# EasyEDA Pro project ProPrj_Multi-Puporse Circuit System Final_2026-03-23.epro, board PCB1
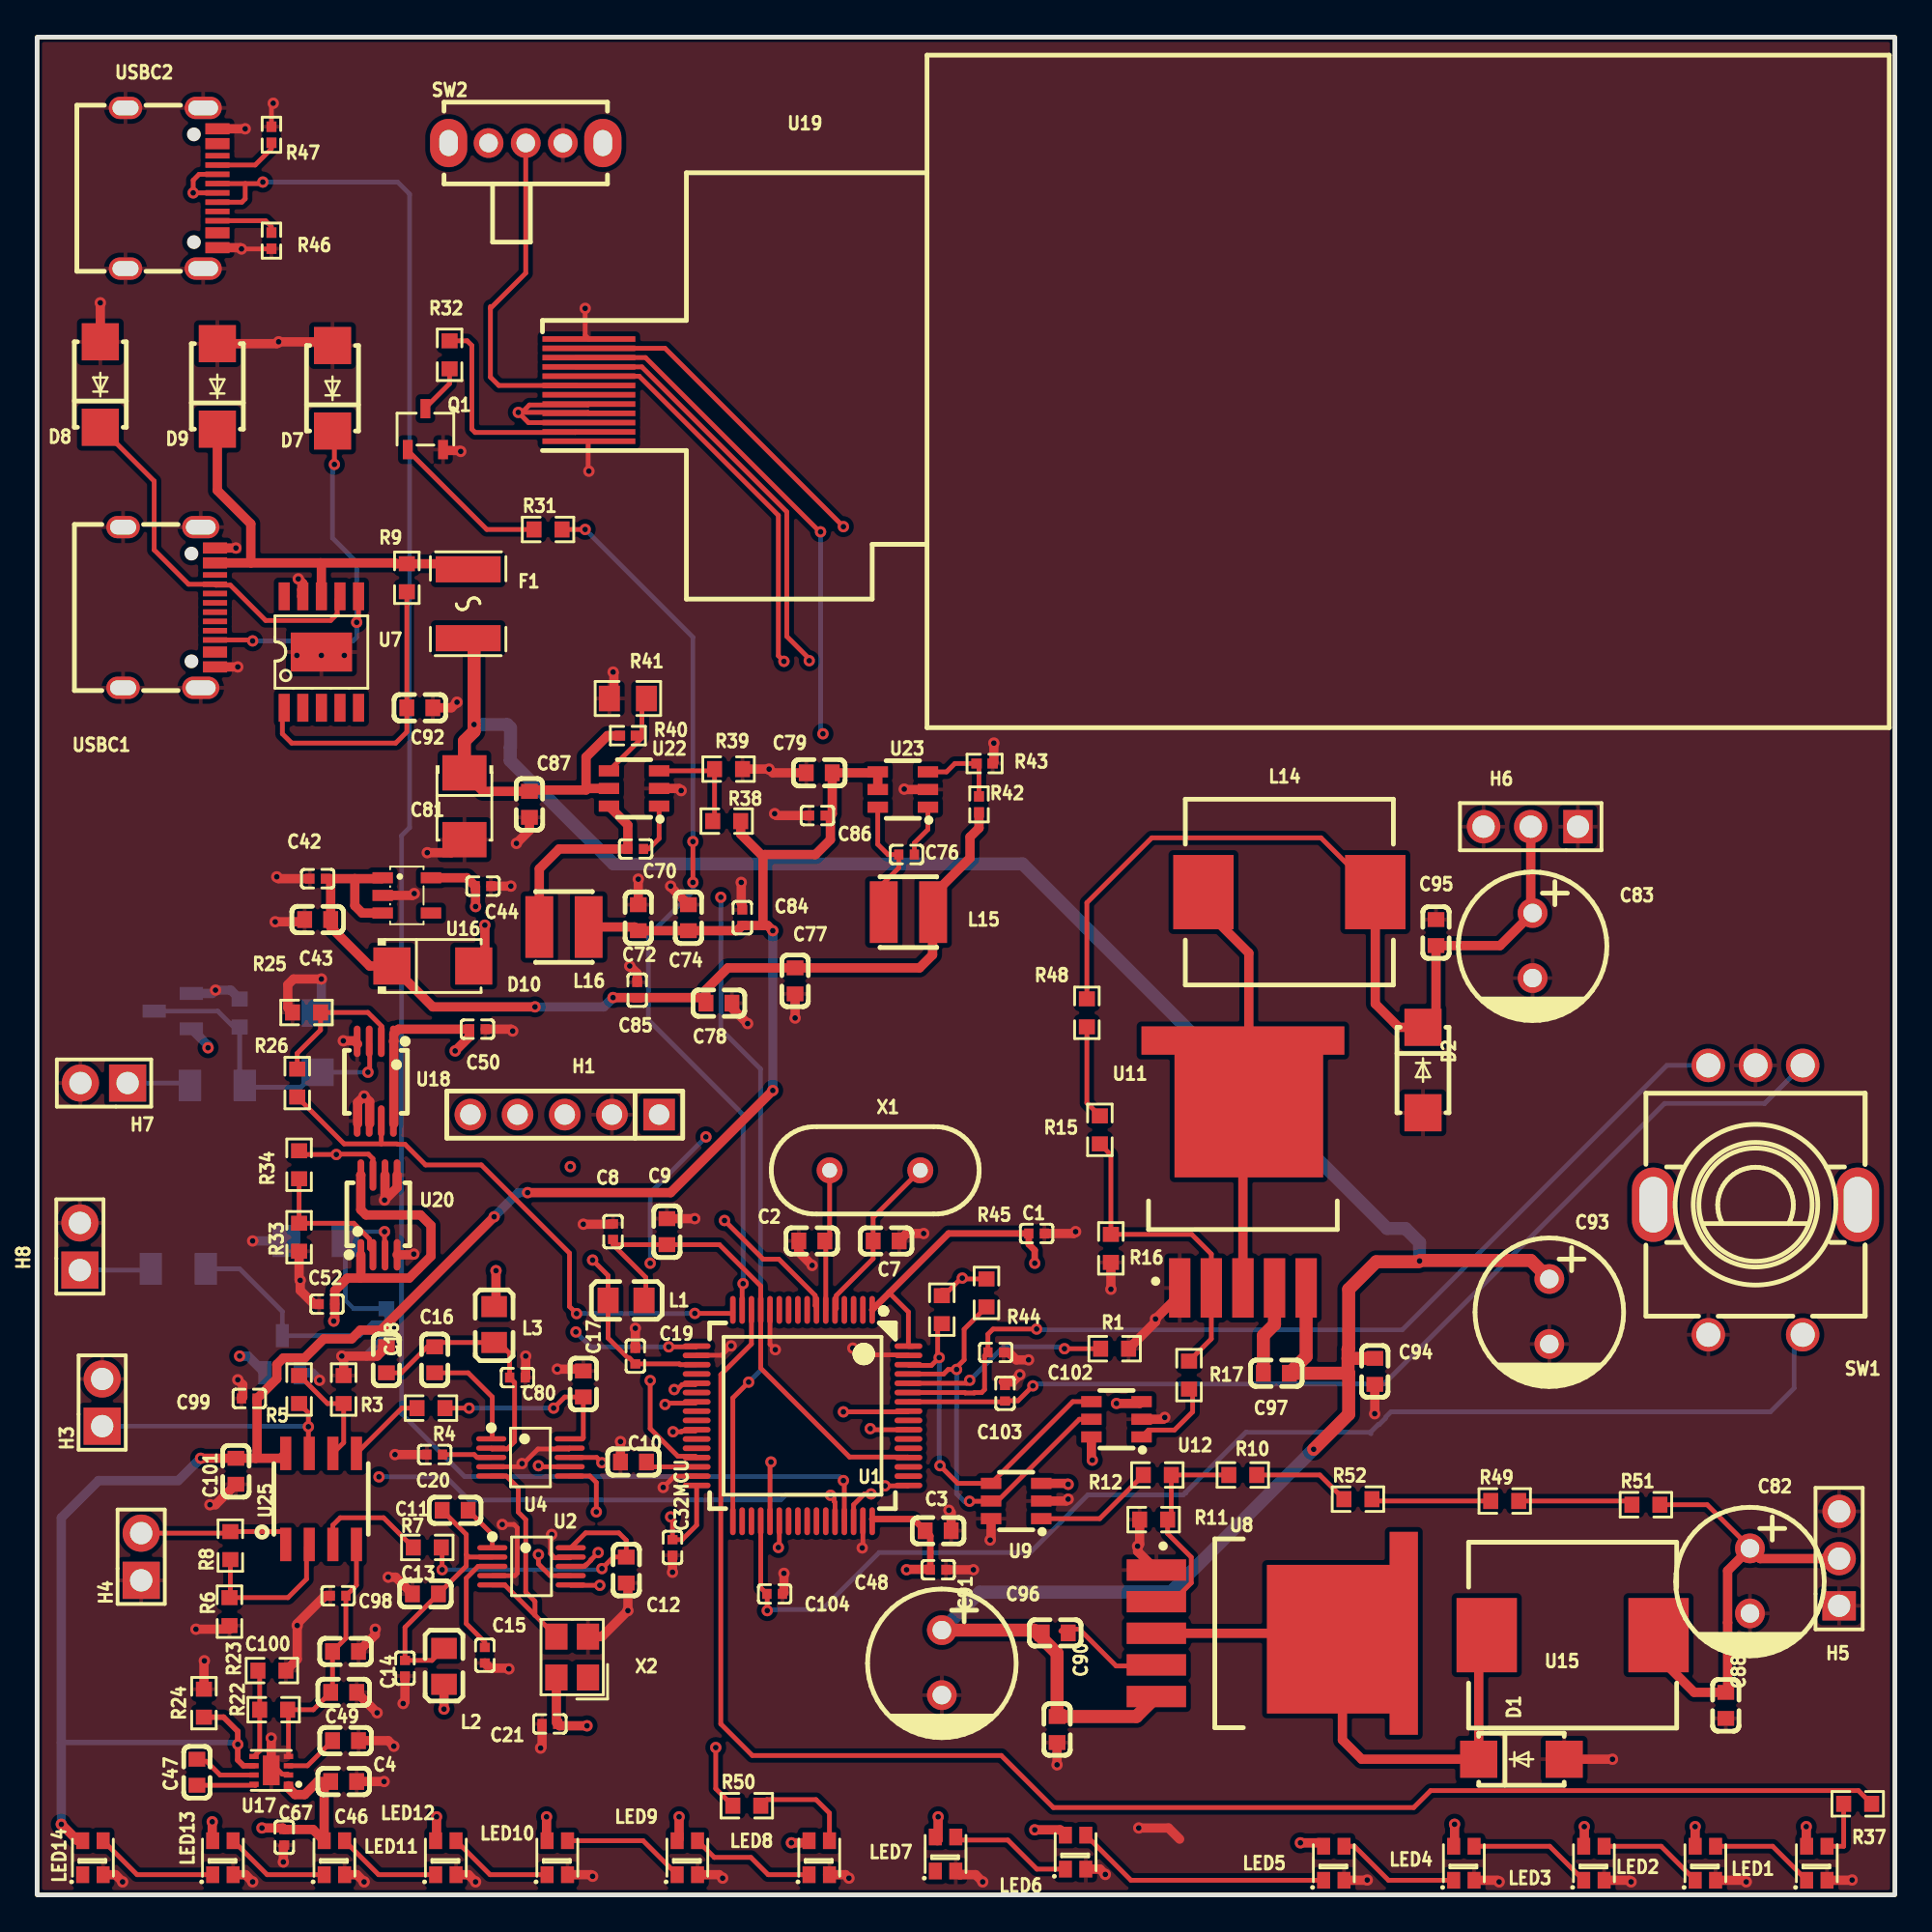
[diagram p1: board, top side]
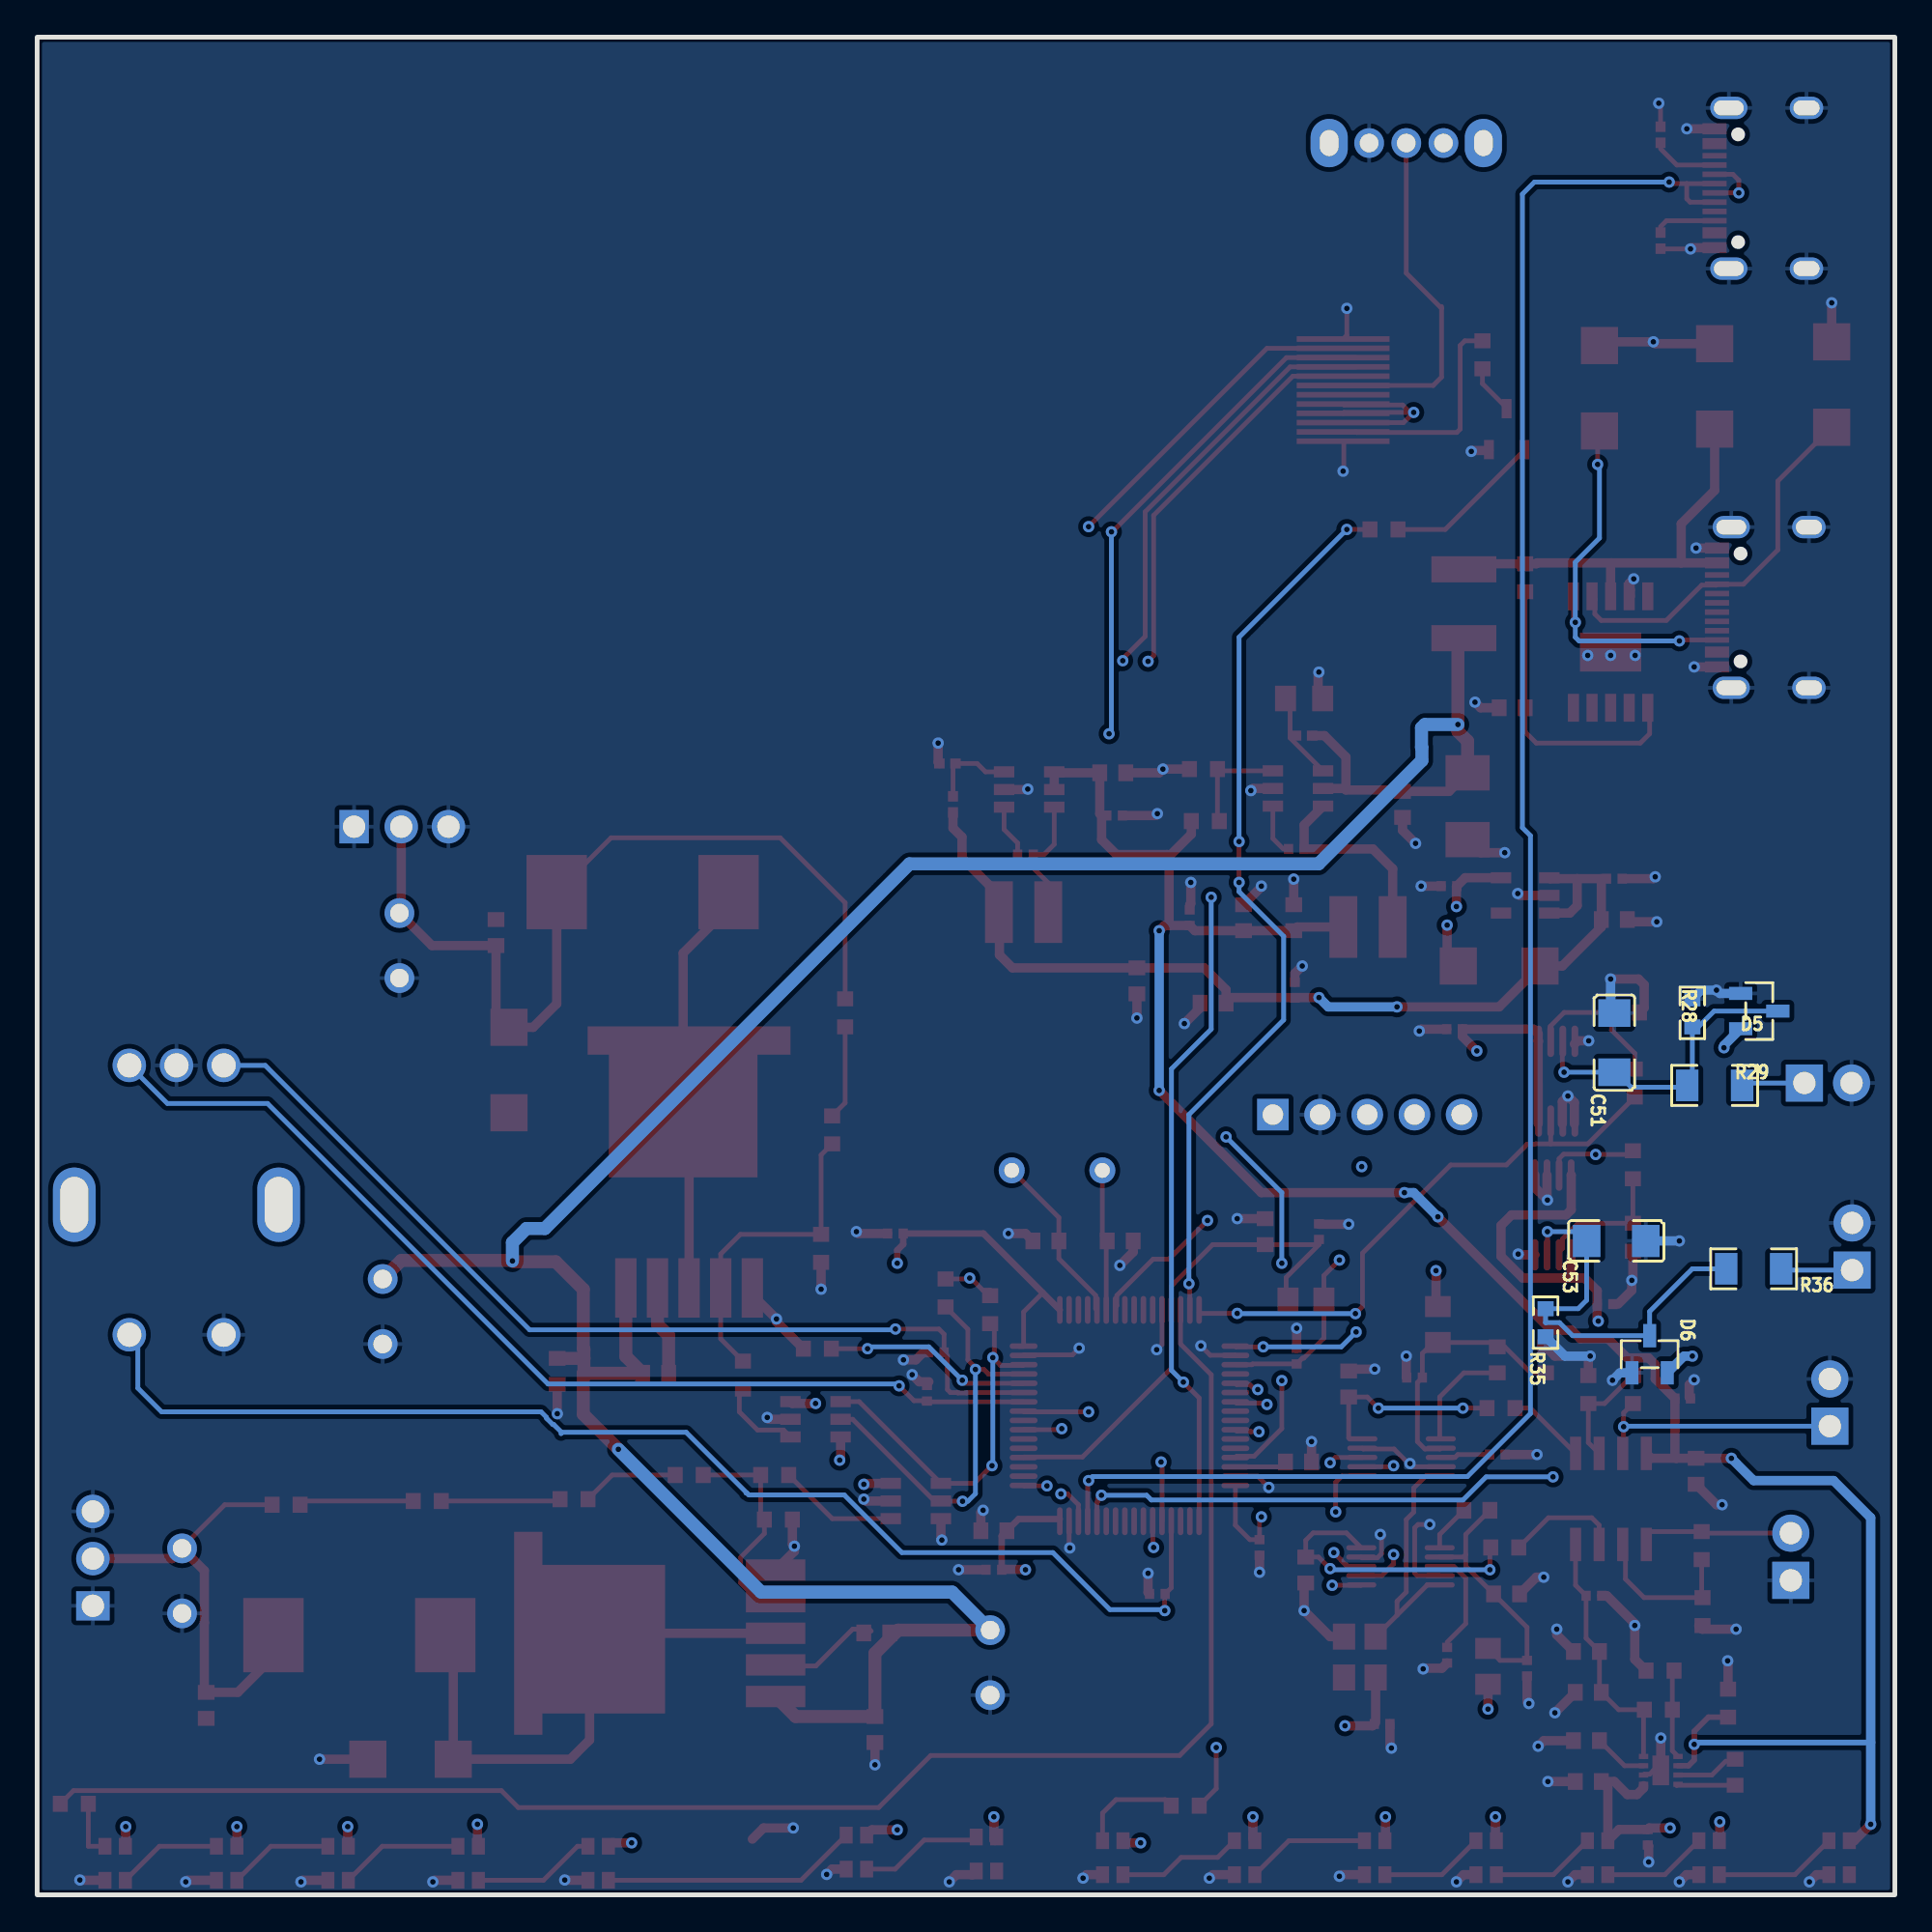
[diagram p2: board, bottom side, seen from below]

Outline 100 x 100 mm; copper layers: Top Layer, Inner1, Inner2, Bottom Layer. Coordinates in mm from the lower left corner of the outline.
Outline path: rectangle 0,0 100,100
Stack: Top Layer 0.0175mm 外层铜厚1oz / Dielectric1 0.1mm 7628 RC49% 8.6mil / Inner1 0.035mm 内层铜厚 / Dielectric2 0.1mm 1.1mm H/HOZ 含铜 / Inner2 0.035mm 内层铜厚 / Dielectric3 0.1mm 7628 RC49% 8.6mil / Bottom Layer 0.0175mm 外层铜厚1oz

## Design rules (mm)
template: 自定义配置
spacing copperThickness1oz (default): track to track 0.2, other pairs 0.152 to 0.3
spacing copperThickness2oz: track to track 0.203, other pairs 0.152 to 0.3
track width copperThickness1oz (default): min 0.127, default 0.254, max 2.54
track width copperThickness2oz: min 0.203, default 0.254, max 2.54
differential pair differentialPair (default): width min 0.127, default 0.254, max 2.54; gap min 0.152, default 0.152
via viaSize (default): diameter min 0.5, default 0.61, max 10; hole min 0.3, default 0.305, max 6.3

## Placement (name value [footprint] x y rotation side)
C1  100nF  [C0402]  53.8 35.6 0 top
C2  22pF  [C0603]  41.7 35.2 0 top
C3  4.7uF  [C0603]  48.5 19.6 180 top
C4  4.7uF  [C0603]  16.6 8.3 180 top
C7  22pF  [C0603]  45.7 35.2 180 top
C8  100nF  [C0402]  31 35.7 90 top
C9  1uF  [C0603]  33.9 35.7 90 top
C10  2.2uF  [C0603]  32.1 23.3 0 top
C11  10nF  [C0603]  22.5 20.7 180 top
C12  22pF  [C0603]  31.71 17.48 90 top
C13  10uF  [C0603]  20.9 16.2 0 top
C14  100nF  [C0402]  19.8 12.2 90 top
C15  100nF  [C0402]  24.1 12.9 270 top
C16  10nF  [C0603]  21.4 28.8 90 top
C17  22pF  [C0603]  29.4 27.5 270 top
C18  10uF  [C0603]  18.8 28.8 270 top
C19  100nF  [C0402]  32.2 29 90 top
C20  100nF  [C0402]  21.4 23.7 180 top
C21  100nF  [C0402]  27.6 9.2 0 top
C32MCU  100nF  [C0402]  34.2 18.7 270 top
C42  100nF  [C0402]  15.1 54.7 180 top
C43  1uF  [C0603]  15.1 52.5 180 top
C44  1uF  [C0402]  24 54.3 0 top
C46  4.7uF  [C0603]  16.5 6.1 180 top
C47  1uF  [C0603]  8.6 6.6 90 top
C48  100nF  [C0402]  48.5 17.5 0 top
C49  2.2uF  [C0603]  16.5 10.9 180 top
C50  100nF  [C0402]  23.7 46.6 180 top
C51  100nF  [C1206]  15.1 45.87 90 bottom
C52  100nF  [C0402]  15.6 31.8 0 top
C53  100nF  [C1206]  15 35.2 180 bottom
C67  100nF  [C0402]  13.3 3.1 90 top
C70  100nF  [C0402]  32.22 56.3 0 top
C72  22pF  [C0603]  32.36 52.6 90 top
C74  22uF  [C0603]  35.06 52.6 270 top
C76  100nF  [C0402]  46.8 56 0 top
C77  22pF  [C0603]  40.8 49.2 270 top
C78  22uF  [C0603]  36.7 48 180 top
C79  4.7uF  [C0603]  42.1 60.4 180 top
C80  100nF  [C0402]  25.85 27.85 180 top
C81  4.7uF  [CAP-SMD_L3.5-W2.8-FD]  23 58.6 270 top
C82  330uF  [CAP-TH_BD8.0-P3.50-D0.6-FD]  92.2 16.9 270 top
C83  330uF  [CAP-TH_BD8.0-P3.50-D0.6-FD]  80.5 51.1 270 top
C84  100nF  [C0402]  37.96 52.6 270 top
C85  100nF  [C0402]  32.3 48.7 270 top
C86  100nF  [C0402]  42 58.1 180 top
C87  100nF  [C0603]  26.5 58.7 270 top
C88  1uF  [C0603]  90.9 10.2 270 top
C90  1uF  [C0603]  54.9 8.9 270 top
C91  220uF  [CAP-TH_BD8.0-P3.50-D0.6-FD]  48.7 12.5 270 top
C92  1uF  [C0603]  20.6 63.9 180 top
C93  220uF  [CAP-TH_BD8.0-P3.50-D0.6-FD]  81.4 31.4 270 top
C94  1uF  [C0603]  72.01 28.18 270 top
C95  1uF  [C0603]  75.3 51.8 90 top
C96  1uF  [C0603]  54.8 14.1 0 top
C97  1uF  [C0603]  66.71 28.08 180 top
C98  100nF  [C0402]  16.2 16.1 0 top
C99  100nF  [C0402]  11.42 26.72 180 top
C100  4.7uF  [C0603]  16.6 13.1 0 top
C101  4.7uF  [C0603]  10.7 22.8 90 top
C102  100nF  [C0402]  51.6 29.2 0 top
C103  100nF  [C0402]  52.1 27 270 top
C104  100nF  [C0402]  39.7 16.2 180 top
D1  B250AF-13  [DO-214AC_L4.3-W2.7-LS5.3-RD]  79.9 7.3 0 top
D2  B250AF-13  [DO-214AC_L4.3-W2.7-LS5.3-RD]  74.6 44.4 270 top
D5  BAV99  [SOT-23-3_L2.9-W1.3-P1.90-LS2.4-BR]  7.3 47.57 0 bottom
D6  BAV99  [SOT-23-3_L2.9-W1.3-P1.90-LS2.4-BR]  13.2 29.1 270 bottom
D7  B250AF-13  [DO-214AC_L4.3-W2.7-LS5.3-RD]  15.9 81.1 90 top
D8  B250AF-13  [DO-214AC_L4.3-W2.7-LS5.3-RD]  3.4 81.3 90 top
D9  B250AF-13  [DO-214AC_L4.3-W2.7-LS5.3-RD]  9.7 81.2 90 top
D10  SS14  [SMA_L4.3-W2.6-LS5.1-RD]  21.3 50 0 top
F1  JK-MSMD110-24V  [F1812]  23.2 69.5 270 top
H1  2.54-1*5  [HDR-TH_5P-P2.54-V-M]  28.4 42 180 top
H3  HX PH254-01-02-Z-L11.5 male header connector  [HDR-TH_2P-P2.54-V-M]  3.5 26.5 90 top
H4  HX PH254-01-02-Z-L11.5 male header connector  [HDR-TH_2P-P2.54-V-M]  5.6 18.2 90 top
H5  HX PH254-01-03-Z-L11.5 pcb pin header  [HDR-TH_3P-P2.54-V-M-1]  97 18.1 90 top
H6  HX PH254-01-03-Z-L11.5 pcb pin header  [HDR-TH_3P-P2.54-V-M-1]  80.4 57.5 180 top
H7  HX PH254-01-02-Z-L11.5 male header connector  [HDR-TH_2P-P2.54-V-M]  3.6 43.7 180 top
H8  HX PH254-01-02-Z-L11.5 male header connector  [HDR-TH_2P-P2.54-V-M]  2.3 34.9 90 top
L1  HCB2012KV-601T20  [L0805]  31.7 32 180 top
L2  HCB2012KV-601T20  [L0805]  21.9 12.3 270 top
L3  HCB2012KV-601T20  [L0805]  24.6 30.7 90 top
L14  47uH  [IND-SMD_L11.0-W10.2_CXP1050]  67.41 53.98 0 top
L15  10uH  [IND-SMD_L3.0-W3.0]  46.9 52.9 180 top
L16  10uH  [IND-SMD_L3.0-W3.0]  28.36 52.1 180 top
LED1  WS2812B-2020  [LED-SMD_4P-L2.0-W2.0-TL_WS2812B-2020]  95.8 1.7 90 top
LED2  WS2812B-2020  [LED-SMD_4P-L2.0-W2.0-TL_WS2812B-2020]  89.8 1.7 90 top
LED3  WS2812B-2020  [LED-SMD_4P-L2.0-W2.0-TL_WS2812B-2020]  83.8 1.7 90 top
LED4  WS2812B-2020  [LED-SMD_4P-L2.0-W2.0-TL_WS2812B-2020]  76.8 1.7 90 top
LED5  WS2812B-2020  [LED-SMD_4P-L2.0-W2.0-TL_WS2812B-2020]  69.8 1.7 90 top
LED6  WS2812B-2020  [LED-SMD_4P-L2.0-W2.0-TL_WS2812B-2020]  55.9 2.3 90 top
LED7  WS2812B-2020  [LED-SMD_4P-L2.0-W2.0-TL_WS2812B-2020]  48.9 2.2 90 top
LED8  WS2812B-2020  [LED-SMD_4P-L2.0-W2.0-TL_WS2812B-2020]  42.1 2 90 top
LED9  WS2812B-2020  [LED-SMD_4P-L2.0-W2.0-TL_WS2812B-2020]  35 2 90 top
LED10  WS2812B-2020  [LED-SMD_4P-L2.0-W2.0-TL_WS2812B-2020]  28 2 90 top
LED11  WS2812B-2020  [LED-SMD_4P-L2.0-W2.0-TL_WS2812B-2020]  22 2 90 top
LED12  WS2812B-2020  [LED-SMD_4P-L2.0-W2.0-TL_WS2812B-2020]  16 2 90 top
LED13  WS2812B-2020  [LED-SMD_4P-L2.0-W2.0-TL_WS2812B-2020]  10 2 90 top
LED14  WS2812B-2020  [LED-SMD_4P-L2.0-W2.0-TL_WS2812B-2020]  3 2 90 top
Q1  L2N7002SLLT1G  [SOT-23-3_L3.0-W1.7-P0.95-LS2.9-BR]  20.9 78.9 270 top
R1  10kΩ  [R0603]  58 29.4 0 top
R3  10kΩ  [R0603]  16.5 27.2 270 top
R4  10kΩ  [R0603]  21.2 26.2 180 top
R5  40kΩ  [R0603]  14.1 27.2 270 top
R6  40kΩ  [R0603]  10.35 15.25 90 top
R7  10kΩ  [R0603]  21 18.7 180 top
R8  40kΩ  [R0603]  10.4 18.8 90 top
R9  1kΩ  [R0603]  19.9 70.9 270 top
R10  15kΩ  [R0603]  64.9 22.6 0 top
R11  1.2kΩ  [R0603]  60.1 20.2 0 top
R12  2.2kΩ  [R0603]  60.3 22.6 0 top
R15  15kΩ  [R0603]  57.21 41.18 90 top
R16  1.2kΩ  [R0603]  57.8 34.8 90 top
R17  2.2kΩ  [R0603]  62.01 27.98 90 top
R22  10kΩ  [R0603]  12.73 9.97 0 top
R23  32kΩ  [R0603]  12.64 12.07 180 top
R24  10kΩ  [R0603]  8.98 10.32 270 top
R25  1kΩ  [R0603]  14.5 47.5 0 top
R26  47kΩ  [R0603]  14 43.7 270 top
R28  1MΩ  [R0603]  10.9 47.47 270 bottom
R29  10kΩ  [R1206]  9.7 43.57 0 bottom
R31  1kΩ  [R0603]  27.5 73.5 0 top
R32  10Ω  [R0603]  22.2 82.9 90 top
R33  1kΩ  [R0603]  14.1 35.4 90 top
R34  47kΩ  [R0603]  14.1 39.3 90 top
R35  1MΩ  [R0603]  18.8 30.8 90 bottom
R36  10kΩ  [R1206]  7.6 33.7 0 bottom
R37  100Ω  [R0603]  98 4.9 180 top
R38  73.2kΩ  [R0603]  37.12 57.8 0 top
R39  10kΩ  [R0603]  37.22 60.6 180 top
R40  100kΩ  [R0402]  31.8 62.4 0 top
R41  25kΩ  [R0805]  31.8 64.4 180 top
R42  100kΩ  [R0402]  50.7 58.7 270 top
R43  20kΩ  [R0402]  51 60.9 180 top
R44  10kΩ  [R0603]  51.1 32.4 90 top
R45  10kΩ  [R0603]  48.7 31.5 90 top
R46  5.1kΩ  [R0402]  12.61 89.05 270 top
R47  5.1kΩ  [R0402]  12.61 94.75 90 top
R48  0Ω  [R0603]  56.51 47.48 90 top
R49  0Ω  [R0603]  79 21.2 0 top
R50  100Ω  [R0603]  38.2 4.8 0 top
R51  0Ω  [R0603]  86.6 21 0 top
R52  0Ω  [R0603]  71.1 21.3 0 top
SW1  EC11E15244B2  [SW-TH_EC11XXXXXXXX]  92.5 37.4 180 top
SW2  SK12D07VG3  [SW-TH_SK12D07VG3]  26.3 94.3 0 top
U1  STM32F401RET6  [LQFP-64_L10.0-W10.0-P0.50-LS12.0-BL]  41.2 25.8 180 top
U2  AD9833BRMZ-REEL7  [MSOP-10_L3.0-W3.0-P0.50-LS5.0-BL]  26.61 17.68 270 top
U4  AD9833BRMZ-REEL7  [MSOP-10_L3.0-W3.0-P0.50-LS5.0-BL]  26.55 23.55 270 top
U7  CH224K  [ESSOP-10_L4.9-W3.9-P1.0-LS6.0-TL-EP]  15.3 66.9 0 top
U8  XL4015E1  [TO-263-5_L10.2-W8.9-P1.70-TL]  65.26 14.08 0 top
U9  MCP4725A1T-E/CH  [SOT-23-6_L2.9-W1.6-P0.95-LS2.8-BR]  52.7 21.2 0 top
U11  XL4015E1  [TO-263-5_L10.2-W8.9-P1.70-TL]  64.91 37.68 90 top
U12  MCP4725A1T-E/CH  [SOT-23-6_L2.9-W1.6-P0.95-LS2.8-BR]  58.1 25.6 0 top
U15  47uH  [IND-SMD_L11.0-W10.2_CXP1050]  82.66 13.98 180 top
U16  LP5907MFX-3.3  [SOT-23-5_L3.0-W1.7-P0.95-LS2.8-BR]  19.9 53.8 180 top
U17  LM27761DSGR  [WSON-8_L2.0-W2.0-P0.65-BL-EP]  12.6 6.7 90 top
U18  ADCMP602BRMZ  [MSOP-8_L3.0-W3.0-P0.65-LS5.0-BL]  18.2 43.8 180 top
U19  HS20HS072RX  [OLED-SMD_HS20HS072RX]  29.7 81 270 top
U20  ADCMP602BRMZ  [MSOP-8_L3.0-W3.0-P0.65-LS5.0-BL]  18.4 36.6 0 top
U22  SY8201CABC  [SOT-23-6_L2.9-W1.6-P0.95-LS2.8-BR]  32.13 59.56 0 top
U23  SY8201CABC  [SOT-23-6_L2.9-W1.6-P0.95-LS2.8-BR]  46.6 59.5 0 top
U25  TSH22IDT  [SO-8_L4.9-W3.9-P1.27-LS6.0-BL]  15.28 21.31 0 top
USBC1  TYPE-C-31-M-12  [USB-C_SMD-TYPE-C-31-M-12_1]  7.1 69.3 270 top
USBC2  TYPE-C-31-M-12  [USB-C_SMD-TYPE-C-31-M-12_1]  7.23 91.87 270 top
X1  8MHz  [CRYSTAL-TH_L11.1-W4.7]  45.1 39 0 top
X2  25MHz  [OSC-SMD_4P-L3.2-W2.5-BL-OXETDLJANF-0.032768MHZ]  28.8 12.8 90 top

## Footprints (pads in the part's own frame, mm; a bottom-side part is the same pattern mirrored in y, then rotated)
C0402
  rect 0.5x0.54 smd: 1(-0.42,0) 2(0.42,0)
C0603
  rect 0.8x0.9 smd: 1(-0.7,0) 2(0.7,0)
C1206
  rect 1.485x1.728 smd: 1(-1.593,0) 2(1.593,0)
CAP-SMD_L3.5-W2.8-FD
  rect 1.9x2.376 smd: 1(-1.798,0) 2(1.798,0)
CAP-TH_BD8.0-P3.50-D0.6-FD
  round 1.6 hole 1: 1(-1.75,0) 2(1.75,0)
CRYSTAL-TH_L11.1-W4.7
  round 1.4 hole 0.8: 1(-2.44,0) 2(2.44,0)
DO-214AC_L4.3-W2.7-LS5.3-RD
  rect 2x2 smd: 1(-2.3,0) 2(2.3,0)
ESSOP-10_L4.9-W3.9-P1.0-LS6.0-TL-EP
  rect 0.6x1.5 smd: 1(-2,-3) 2(-1,-3) 3(0,-3) 4(1,-3) 5(2,-3) 6(2,3) 7(1,3) 8(0,3) 9(-1,3) 10(-2,3)
  rect 3.3x2.1 smd: 11(0,0)
F1812
  rect 1.407x3.499 smd: 1(-1.853,0) 2(1.853,0)
HDR-TH_2P-P2.54-V-M
  rect 2x2 hole 1.2: 1(-1.27,0)
  round 2 hole 1.2: 2(1.27,0)
HDR-TH_3P-P2.54-V-M-1
  rect 1.575x1.8 hole 1.2: 1(-2.54,0)
  round 1.8 hole 1.2: 2(0,0) 3(2.54,0)
HDR-TH_5P-P2.54-V-M
  rect 1.7x1.7 hole 1.1: 1(-5.08,0)
  round 1.7 hole 1.1: 2(-2.54,0) 3(0,0) 4(2.54,0) 5(5.08,0)
IND-SMD_L3.0-W3.0
  rect 1.5x3.32 smd: 1(1.328,0) 2(-1.328,0)
IND-SMD_L11.0-W10.2_CXP1050
  rect 3.25x4 smd: 1(-4.625,0) 2(4.625,0)
L0805
  rect 1.133x1.377 smd: 1(-0.966,0) 2(0.966,0)
LED-SMD_4P-L2.0-W2.0-TL_WS2812B-2020
  rect 0.9x0.7 smd: 1(-0.915,0.55) 2(-0.915,-0.55) 3(0.915,-0.55) 4(0.915,0.55)
LQFP-64_L10.0-W10.0-P0.50-LS12.0-BL
  oval 0.3x1.5 smd: 1(-3.75,-5.688) 2(-3.25,-5.688) 3(-2.75,-5.688) 4(-2.25,-5.688) 5(-1.75,-5.688) 6(-1.25,-5.688) 7(-0.75,-5.688) 8(-0.25,-5.688) 9(0.25,-5.688) 10(0.75,-5.688) 11(1.25,-5.688) 12(1.75,-5.688) 13(2.25,-5.688) 14(2.75,-5.688) 15(3.25,-5.688) 16(3.75,-5.688) 33(3.75,5.688) 34(3.25,5.688) 35(2.75,5.688) 36(2.25,5.688) 37(1.75,5.688) 38(1.25,5.688) 39(0.75,5.688) 40(0.25,5.688) 41(-0.25,5.688) 42(-0.75,5.688) 43(-1.25,5.688) 44(-1.75,5.688) 45(-2.25,5.688) 46(-2.75,5.688) 47(-3.25,5.688) 48(-3.75,5.688)
  oval 1.5x0.3 smd: 17(5.7,-3.738) 18(5.7,-3.238) 19(5.7,-2.738) 20(5.7,-2.238) 21(5.7,-1.738) 22(5.7,-1.238) 23(5.7,-0.739) 24(5.7,-0.238) 25(5.7,0.262) 26(5.7,0.762) 27(5.7,1.262) 28(5.7,1.762) 29(5.7,2.261) 30(5.7,2.762) 31(5.7,3.261) 32(5.7,3.762) 49(-5.7,3.762) 50(-5.7,3.261) 51(-5.7,2.762) 52(-5.7,2.261) 53(-5.7,1.762) 54(-5.7,1.262) 55(-5.7,0.762) 56(-5.7,0.262) 57(-5.7,-0.238) 58(-5.7,-0.739) 59(-5.7,-1.238) 60(-5.7,-1.738) 61(-5.7,-2.238) 62(-5.7,-2.738) 63(-5.7,-3.238) 64(-5.7,-3.738)
MSOP-8_L3.0-W3.0-P0.65-LS5.0-BL
  oval 0.364x1.692 smd: 1(-0.975,-2.146) 2(-0.325,-2.146) 3(0.325,-2.146) 4(0.975,-2.146) 5(0.975,2.146) 6(0.325,2.146) 7(-0.325,2.146) 8(-0.975,2.146)
MSOP-10_L3.0-W3.0-P0.50-LS5.0-BL
  oval 0.28x1.62 smd: 1(-1,-2.11) 2(-0.5,-2.11) 3(0,-2.11) 4(0.5,-2.11) 5(1,-2.11) 6(1,2.11) 7(0.5,2.11) 8(0,2.11) 9(-0.5,2.11) 10(-1,2.11)
OLED-SMD_HS20HS072RX
  rect 0.3x5 smd: 1(-2.75,0) 2(-2.25,0) 3(-1.75,0) 4(-1.25,0) 5(-0.75,0) 6(-0.25,0) 7(0.25,0) 8(0.75,0) 9(1.25,0) 10(1.75,0) 11(2.25,0) 12(2.75,0)
OSC-SMD_4P-L3.2-W2.5-BL-OXETDLJANF-0.032768MHZ
  rect 1.4x1.2 smd: 1(-1.1,-0.85) 2(1.1,-0.85) 3(1.1,0.85) 4(-1.1,0.85)
R0402
  rect 0.566x0.54 smd: 1(-0.433,0) 2(0.433,0)
R0603
  rect 0.806x0.864 smd: 1(-0.753,0) 2(0.753,0)
R0805
  rect 1.133x1.377 smd: 1(-1,0) 2(1,0)
R1206
  rect 1.208x1.701 smd: 1(-1.479,0) 2(1.479,0)
SMA_L4.3-W2.6-LS5.1-RD
  rect 2x2 smd: 1(-2.2,0) 2(2.2,0)
SO-8_L4.9-W3.9-P1.27-LS6.0-BL
  rect 0.6x1.8 smd: 1(-1.905,-2.45) 2(-0.635,-2.45) 3(0.635,-2.45) 4(1.905,-2.45) 5(1.905,2.45) 6(0.635,2.45) 7(-0.635,2.45) 8(-1.905,2.45)
SOT-23-3_L2.9-W1.3-P1.90-LS2.4-BR
  rect 1.25x0.7 smd: 1(1,-0.95) 2(1,0.95) 3(-1,0)
SOT-23-3_L3.0-W1.7-P0.95-LS2.9-BR
  rect 1.038x0.532 smd: 1(1.101,-0.95) 2(1.101,0.95) 3(-1.101,0)
SOT-23-5_L3.0-W1.7-P0.95-LS2.8-BR
  rect 1.1x0.6 smd: 1(1.3,-0.95) 2(1.3,0) 3(1.3,0.95) 4(-1.3,0.95) 5(-1.3,-0.95)
SOT-23-6_L2.9-W1.6-P0.95-LS2.8-BR
  rect 1.1x0.6 smd: 1(1.35,-0.95) 2(1.35,0) 3(1.35,0.95) 4(-1.35,0.95) 5(-1.35,0) 6(-1.35,-0.95)
SW-TH_EC11XXXXXXXX
  oval 2.3x4 hole 1.5x3: 6(5.5,0.25) 7(-5.5,0.25)
  round 1.8 hole 1.3: A(-2.54,-7.25) B(2.54,-7.25) C(0,-7.25) D(-2.54,7.25) E(2.54,7.25)
SW-TH_SK12D07VG3
  oval 1.6x1.6 hole 1: 1(-2,0) 2(0,0) 3(2,0)
  oval 2x2.6 hole 1x1.4: 4(4.15,0) 5(-4.15,0)
TO-263-5_L10.2-W8.9-P1.70-TL
  rect 3.2x1.15 smd: 1(-5.008,3.404) 2(-5.008,1.702) 3(-5.008,0) 4(-5.008,-1.702) 5(-5.008,-3.404)
  custom 8.128x10.922 smd: 6(5.008,-0.318)
USB-C_SMD-TYPE-C-31-M-12_1
  oval 1.2x2 hole 0.8x1.6: 1(4.325,1.706) 4(-4.325,1.706)
  oval 1.2x1.8 hole 0.8x1.4: 2(4.325,-2.474) 3(-4.325,-2.474)
  custom 0.6x1.3 smd: A1B12(-3.2,2.474) A4B9(-2.4,2.474) B1A12(3.2,2.474) B4A9(2.401,2.474)
  rect 0.3x1.3 smd: A5(-1.25,2.474) A6(-0.25,2.474) A7(0.25,2.474) A8(1.25,2.474) B5(1.75,2.474) B6(0.75,2.474) B7(-0.75,2.474) B8(-1.75,2.474)
WSON-8_L2.0-W2.0-P0.65-BL-EP
  rect 0.28x0.505 smd: 1(-0.75,-0.927) 2(-0.25,-0.927) 3(0.25,-0.927) 4(0.75,-0.927) 5(0.75,0.927) 6(0.25,0.927) 7(-0.25,0.927) 8(-0.75,0.927)
  rect 1.6x0.9 smd: 9(0,0)

## Nets
As in the schematic, except:
+3.3V: C1.1 C3.2 C19.1 C21.2 C32MCU.1 C44.1 C48.1 C50.2 C52.2 D5.2 D6.2 D10.2 H1.1 L1.2 L2.2 L3.2 R44.2 R45.2 SW2.1 U1.1 U1.19 U1.32 U1.48 U1.64 U9.3 U12.3 U12.6 U16.5 U18.1 U18.8 U19.8 U19.9 U19.10 U20.1 U20.8 X2.4
GND: C1.2 C2.1 C3.1 C4.1 C7.1 C8.2 C9.2 C10.1 C12.1 C13.1 C14.1 C15.2 C17.1 C18.1 C19.2 C20.2 C21.1 C32MCU.2 C42.2 C43.2 C44.2 C46.1 C48.2 C49.1 C50.1 C51.2 C52.1 C53.2 C67.1 C72.2 C74.1 C77.2 C78.1 C79.2 C80.1 C81.2 C82.2 C83.2 C84.1 C85.1 C86.2 C87.2 C88.2 C90.2 C91.2 C92.1 C93.2 C94.2 C95.2 C98.1 C99.2 C100.2 C101.1 C102.2 C103.1 C104.1 D1.2 D2.2 D5.1 D6.1 D7.2 D8.2 D9.2 H1.2 H3.2 H4.1 H5.1 H5.3 H6.1 H6.3 H7.2 H8.2 LED1.2 LED2.2 LED3.2 LED4.2 LED5.2 LED6.2 LED7.2 LED8.2 LED9.2 LED10.2 LED11.2 LED12.2 LED13.2 LED14.2 Q1.2 R1.2 R3.1 R6.1 R11.1 R16.1 R23.1 R24.1 R25.1 R28.1 R33.1 R35.1 R39.1 R41.2 R43.1 R46.2 R47.2 SW1.C SW1.E SW2.3 U1.12 U1.18 U1.31 U1.47 U1.63 U2.4 U2.9 U4.4 U4.9 U7.9 U7.11 U8.1 U9.2 U9.6 U11.1 U12.2 U16.2 U17.2 U17.9 U18.4 U18.5 U18.6 U19.1 U19.12 U20.4 U20.5 U20.6 U22.2 U23.2 USBC1.1 USBC1.2 USBC1.3 USBC1.4 USBC1.A1B12 USBC1.B1A12 USBC2.1 USBC2.2 USBC2.3 USBC2.4 USBC2.A1B12 USBC2.B1A12 X2.2
$1N4931: H4.2 R8.2 U25.1
$1N6673: D1.1 U8.3 U8.6 U15.2
$1N8343: L14.1 U11.3 U11.6
$1N102112: C83.1 C95.1 D2.1 H6.2 L14.2 R48.2
$1N106296: C82.1 C88.1 H5.2 R51.2 U15.1

Pads without a net: LED14 1; SW1 6 7; SW2 4 5; U1 3 4 8 9 10 11 20 22 24 25 27 34 35 39 40 41 42 43 50 51 53 54 56; U7 2 3 4 5 10; U16 4; U19 7; USBC1 A6 A7 A8 B4A9 B6 B7 B8; USBC2 A4B9 A8 B4A9 B8; X2 1

## Via types
v1: diameter 0.61, hole 0.305, Top Layer to Bottom Layer, 212 vias

## Routing (per net, layer and track width the routed paths; a pad name or vN(x,y) marks a point on that pad's centre or on a via; arc(x,y) is an arc through that point)
3.7VBAD: length 53.3
  Top Layer w0.5: v1(26.8,47.8) 21.3,47.8 D10.1 17.9,50 15.8,52.1 C43.1 15.8,54.7 17.1,54.7 ; v1(31,48.3) 35.7,48.3 C78.2 36,48.72 37.18,49.9 C77.1 47.5,49.9 48.2,50.6 48.2,52.87 L15.2 48.23,53.83 50.22,55.82 50.22,56.94 50.7,57.43 R42.2 ; 17.1,54.7 17.1,53.25 17.5,52.85 U16.3 ; 17.1,54.7 18.55,54.7 U16.1
  Bottom Layer w0.5: v1(26.8,47.8) 30.5,47.8 v1(31,48.3)
+3.3V: length 99.4
  Top Layer w0.254: 26.1,79.8 26.5,80.2 29.65,80.2 U19.8 ; 26.1,79.8 v1(25.9,79.8) 26.45,79.25 U19.10 ; 26.1,79.8 29.65,79.8 U19.9 ; U1.19 34.61,28.54 34.57,28.58 C19.1 31.89,28.89 31.81,28.89 30.73,29.97 30.73,31.94 ; 49.8,33.25 49.9,33.15 R44.2 ; 49.8,33.25 49.09,32.55 48.7,32.55 R45.2 ; 49.8,33.25 v1(49.8,33.2) ; U1.64 46.9,31.38 45.87,32.41 ; U1.32 35.5,19.9 34.72,19.12 C32MCU.1 34.2,20.25 v1(34.1,20.35) ; L1.2 30.73,33.34 v1(29.9,34.17) ; 47.14,29.52 46.92,29.52
  Top Layer w0.35: C48.1 48.08,19.32 C3.2 47.17,20.23 44.95,20.23 ; v1(53.7,34) 53.7,34.7 53.38,35.02 C1.1 49.06,35.6 U1.1
  Top Layer w0.5: 17.42,34.45 17.42,33.22 17.4,33.2 ; L2.2 v1(21.9,10) ; 30.73,31.94 L1.2 ; v1(55.5,22.1) 55.45,22.15 U9.3 ; v1(58.1,26.45) 59.35,26.45 U12.3 ; v1(56.8,23.4) 56.75,23.45 U12.6 ; 19.2,45.97 19.2,46.35 19.45,46.6 C50.2 23.28,46.21 v1(22.5,45.43) ; 19.2,45.97 U18.1 ; 19.2,45.97 19.2,41.51 ; U16.5 23.13,54.75 C44.1 23.6,54.28 v1(23.6,53.2) ; v1(24.7,33.6) 24.7,31.77 L3.2 ; v1(24.1,52.2) 24.1,50.6 D10.2 ; 48.05,17.52 46.82,17.52 v1(46.8,17.5) ; v1(15.97,30.88) 16.02,30.94 C52.2 16.02,32.52 16.7,33.2 17.4,33.2 ; 17.4,33.2 20.03,33.2 21.2,34.37 21.2,36.03 20.63,36.6 17.7,36.6 17.42,36.88 17.42,38.74 17.42,38.75 ; v1(29.6,9.1) 28.12,9.1 C21.2 ; X2.4 27.95,9.27
  Bottom Layer w0.5: D5.2 9.2,45.72 v1(9.2,45.6) ; v1(10.9,29) 11.35,29 D6.2
+5V: length 144.6
  Top Layer w0.3: U17.6 11.11,6.95 10.8,7.26 v1(10.8,8.1) 10.8,8.8 10.03,9.56 R24.2
  Top Layer w0.5: v1(1.3,3.8) 2.19,2.91 LED14.4 ; 48.45,2.91 48.5,2.97 v1(48.5,4.2) ; v1(89.25,3.67) 89.25,2.62 ; L16.2 32.16,52.1 C72.1 C74.2 37.68,51.9 C84.2 39.07,52.18 ; v1(40.6,2.8) 41.44,2.8 LED8.4 ; LED9.4 34.56,3.02 v1(34.56,4.2) ; v1(8.8,23.5) C101.2 11.76,23.5 ; 39.07,52.18 39.32,52.18 v1(39.6,51.9) ; 39.07,52.18 39.07,55.9 ; 39.07,55.9 37.87,57.1 R38.2 ; 39.07,55.9 39.17,56 41.9,56 42.7,56.8 42.7,58.1 42.8,58.2 C79.1 45.2,60.4 U23.4 U23.5 ; v1(26.4,37.8) 34.1,37.8 v1(39.6,43.3) ; U25.8 13.12,23.5 11.76,23.5 ; v1(53.7,3.5) 55.06,3.5 LED6.4 ; v1(27.42,4.2) 27.42,2.94 LED10.4 ; 11.76,23.5 11.84,23.58 C99.1 12.9,27.78 12.9,28.55 13.25,28.9 14.4,28.9 15.43,29.93 16.93,29.93 17.4,30.4 18.5,30.4 v1(24.6,36.5) ; 76.25,2.62 76.3,2.66 v1(76.3,3.8) ; LED11.4 21.5,2.97 v1(21.5,4.2) ; v1(83.28,3.67) 83.28,2.65 83.25,2.62 ; v1(9.42,3.93) 9.42,2.94 LED13.4 ; 13.53,5.87 13.53,5.75 13.88,5.4 14.4,5.4 15.1,6.1 C46.2 15.45,5.75 LED12.4 14.84,3.52 C67.2 13.22,3.6 v1(12.1,3.6) ; 95.25,2.62 95.23,2.63 v1(95.23,3.67) ; 69.25,2.62 69.06,2.8 v1(68,2.8)
  Bottom Layer w0.3: v1(10.8,8.1) 10.7,8.2 1.3,8.2
  Bottom Layer w0.5: v1(1.3,3.8) 1.3,20.3 3.3,22.3 7.6,22.3 v1(8.8,23.5) ; v1(26.4,37.8) 25.9,37.8 v1(24.6,36.5) ; v1(39.6,43.3) v1(39.6,51.9)
+20V: length 154.8
  Top Layer w0.5: C81.1 24,59.4 C87.1 26.57,59.47 29.55,59.47 29.55,61.25 30.7,62.4 R40.1 ; 29.63,59.56 U22.5
  Top Layer w0.7: U8.5 59.17,9.6 C90.1 54.9,13 53.65,14.25 49,14.25 ; 70.6,28.08 C97.1 68.31,28.98 U11.5 ; 70.6,28.08 70.6,25.87 v1(68.72,23.99) ; 70.6,28.08 70.57,28.11 70.57,28.88 ; 70.57,28.88 70.57,29.37 70.6,29.4 70.6,32.59 72.09,34.08 74.37,34.08 ; 70.57,28.88 C94.1 ; 74.44,34.15 80.4,34.15 C93.1 ; C81.1 23,62.11 23.52,62.63 v1(23.52,63) 23.52,67.33 F1.2 ; 49.05,14.3 49.03,14.32
  Bottom Layer w0.7: v1(68.72,23.99) 61.03,16.3 50.75,16.3 C91.1 ; v1(74.42,34.12) 74.42,35.11 73.66,35.87 72.67,35.87 53.04,55.5 31.02,55.5 25.46,61.06 25.46,61.76 25.48,61.77 25.48,62.82 25.3,63 v1(23.52,63)
-5V: length 13.8
  Top Layer w0.254: 17.19,18.86 17.19,16.67 C98.2 16.62,13.82 C100.1 15.9,11 C49.2 14.86,9.97 R22.2 13.53,9.92 U17.4
GND: length 196.9
  Top Layer w0.254: U17.9 12.99,6.7 13.19,6.5 13.48,6.5 U17.2 ; U4.9 28.62,24 26.96,24 26.17,23.22 v1(26.1,23.22) 25.93,23.05 U4.4 ; v1(12.71,96.44) 12.61,96.35 12.61,95.5 ; v1(11,88.6) 12.6,88.6 R46.2 ; U19.1 29.5,83.95 v1(29.5,85.4) ; U2.9 28.68,18.14 27.86,18.14 27.63,18.37 27.63,19.33 ; U1.63 46.87,29.07 44.27,29.07 v1(43.91,29.43) ; U19.12 29.66,78.21 29.66,76.68 v1(29.7,76.64) ; v1(33.7,21.93) 34.31,22.54 U1.31 ; v1(25.04,19.94) 25.67,19.94 25.85,19.76 25.85,17.31 25.72,17.18 U2.4 ; U1.18 35.51,29.05 36.85,29.05 v1(37.36,29.55) ; U1.12 39.45,29.63 v1(39.74,29.35) ; v1(44.41,18.68) 44.45,18.71 U1.47
  Top Layer w0.5: LED4.2 78.62,0.78 v1(78.7,0.7) ; U22.2 34.55,59.56 v1(34.67,59.44) ; C80.1 26.3,27.87 v1(26.3,29) ; LED1.2 97.69,0.78 v1(97.7,0.8) ; v1(25.6,46.5) 25.5,46.6 C50.1 ; v1(22.8,77.7) 22.75,77.75 21.85,77.75 ; LED12.2 17.22,1.09 v1(17.6,0.7) ; R23.1 14,12.68 v1(14,14.5) 14,14.6 15.5,16.1 C98.1 ; R25.1 13.49,47.75 13.49,48.99 13.8,49.3 v1(15.3,49.3) ; v1(16.48,45.97) 17.08,45.97 17.25,45.8 ; 31.05,64.4 31.05,65.78 v1(31,65.82) ; v1(51.3,19.1) 51.35,19.15 U9.6 ; v1(60.7,25.7) 60.6,25.6 U12.2 ; C12.1 31.8,16.7 v1(31.8,15.3) 30.4,13.9 X2.2 ; C9.2 v1(35.4,36.4) ; R1.2 60.2,30.85 v1(60.2,31) 61.5,32.3 U11.1 ; 41.3,58.1 39.8,58.1 v1(39.7,58.2) ; R11.1 59.35,18.88 v1(59.24,18.77) 59.24,18.49 U8.1 ; C15.2 24.38,12.2 25.36,12.2 v1(25.39,12.16) ; LED2.2 91.91,0.78 v1(92,0.7) ; USBC1.B1A12 v1(10.8,66.1) ; C99.2 11.07,26.79 11.07,27.46 v1(10.8,27.72) ; v1(32.2,30.5) C19.2 ; v1(41.72,33.88) 41,34.6 C2.1 ; v1(27.1,7.9) 27.18,7.98 C21.1 ; v1(34.2,17.37) C32MCU.2 ; v1(36.9,0.9) 36.72,1.09 LED9.2 ; v1(49.08,20.7) 49.2,20.58 C3.1 ; v1(14.06,70.84) 14.3,70.6 14.3,70.31 14.24,70.25 14.24,69.9 U7.9 ; C90.2 54.9,8.2 v1(54.9,7) ; v1(37.9,54.5) 37.9,53.36 37.96,53.3 ; C92.1 22.3,63.9 v1(22.6,64.2) ; C10.1 v1(31.4,24.4) ; C46.1 v1(18.68,6.1) ; C4.1 18.9,8.3 v1(19.2,8) ; 10.55,14.49 10.36,14.3 v1(8.55,14.3) ; v1(31.9,50) 32.3,49.6 C85.1 ; D7.2 15.7,83.6 v1(13,83.6) 12.9,83.5 D9.2 ; v1(19.7,10.3) 19.8,10.4 19.8,11.5 ; v1(18.9,17.1) 19.3,17.1 C13.1 ; C72.2 32.36,54.67 ; v1(55.9,35.7) 55.8,35.6 C1.2 ; 56.45,1.38 57.22,1.38 v1(57.5,1.1) ; v1(46.68,59.52) 46.7,59.5 U23.2 ; D1.2 v1(84.8,7.3) ; 17.9,41.51 17.9,42.7 v1(17.6,43) 17.25,42.65 17.25,41.51 ; LED11.2 23.22,1.09 v1(23.6,0.7) ; U9.2 55.4,21.2 v1(55.5,21.3) ; U20.5 19.38,38.08 18.72,37.42 ; R43.1 51.5,60.97 v1(51.5,62) ; 61.5,3 60.9,3.6 v1(59.3,3.6) ; C18.1 18.3,29 v1(16.4,29) 16.5,28.9 R3.1 ; C49.1 v1(18.3,9.8) ; 52,27.62 52.52,27.62 v1(52.9,28) ; v1(25.8,56.6) 26.5,57.3 C87.2 ; 27.63,19.33 v1(27.7,19.4) ; LED14.2 4.22,1.09 v1(4.6,0.7) ; v1(28,28.3) 29.3,28.3 C17.1 ; 49.2,17.5 v1(50.4,17.5) ; C94.2 72.01,25.91 v1(72,25.9) ; v1(53.37,28.8) 52.7,28.8 52.3,29.2 ; 42.55,1.09 43.51,1.09 v1(43.7,0.9) ; USBC2.A1B12 v1(11.2,95.07) ; v1(11.6,0.7) 11.22,1.09 LED13.2 ; C8.2 30.98,36.1 v1(29.4,36.1) ; C79.2 39.6,60.4 v1(39.4,60.6) R39.1 ; v1(29.9,1) 29.81,1.09 LED10.2 ; LED3.2 85.72,0.78 v1(85.8,0.7) ; R16.1 v1(57.8,32.6) ; LED5.2 71.59,0.78 v1(71.6,0.8) ; 14.9,31.8 14.16,32.54 v1(14.16,33.08) 14.1,33.14 R33.1 ; C7.1 46.8,35.6 v1(47.72,35.6) ; C101.1 9.6,21 v1(9.3,21) ; C74.1 34.1,54.26 v1(34.1,54.3) ; 18.72,37.42 18.72,38.75 ; 18.72,37.42 v1(18.7,37.4) ; R24.1 8.98,12.58 v1(9,12.6) ; U20.4 20.24,34.45 v1(20.28,34.49) ; C104.1 40.2,16.28 v1(40.2,17.31) ; v1(13.25,1.77) 13.25,2.63 C67.1 ; v1(18.2,14.3) 18.2,14 C100.2 ; LED7.2 49.65,1.09 50.51,1.09 v1(50.9,0.7) ; U16.2 20.2,53.8 v1(20.3,53.9) ; C81.2 22.3,56.1 v1(21,56.1) ; USBC1.A1B12 v1(10.7,72.5) ; D8.2 v1(3.4,85.7) ; v1(11,88.6) 10.93,88.67 USBC2.B1A12 ; C77.2 v1(40.8,47.2) ; v1(12.81,52.38) 14.28,52.38 C43.2 ; C44.2 v1(25.5,54.3) ; v1(19.26,23.7) 20.7,23.7 ; 14.4,54.7 13,54.7 v1(12.9,54.8) ; C78.1 37.4,47.75 v1(38.25,46.9) ; v1(12.6,8.44) U17.9
  Bottom Layer w0.5: v1(15.2,27.7) 14.8,28.1 D6.1 ; C51.2 15.3,47.67 v1(15.3,49.3) ; C53.2 v1(11.6,35.2) ; v1(16.4,29) 17.75,29 R35.1 ; D5.1 9.42,48.52 v1(9.6,48.7) 10.43,48.7 10.9,48.23
  vias: v1(13.98,66.72) v1(15.3,66.72) v1(16.53,66.72) v1(32.36,54.67)
$1N585: length 9.4
  Top Layer w0.254: X1.2 45,36.46 C7.2 45,34.25 43.02,32.27 43.02,31.56 U1.5
$1N596: length 7.6
  Top Layer w0.254: U1.6 42.45,35.15 C2.2 42.66,35.46 X1.1
$1N1851: length 23.4
  Top Layer w0.254: v1(37,36.3) 39.08,34.22 39.93,34.22 41.88,32.27 41.88,31.72 41.95,31.65 U1.7
  Inner2 w0.254: H1.5 27.92,37.4 35.9,37.4 v1(37,36.3)
$1N1913: length 11.2
  Top Layer w0.254: U1.60 50.04,27.54 v1(50.2,27.7) ; v1(55.3,29.4) R1.1
  Bottom Layer w0.254: v1(50.2,27.7) 52,29.5 55.2,29.5 v1(55.3,29.4)
$1N2152: length 2.6
  Top Layer w0.254: C11.1 24.5,19.4 U2.1
$1N2458: length 5.5
  Top Layer w0.254: U2.3 23.74,17.68 23.1,17.04 23.1,14.6 24.1,13.6
$1N3323: length 15.8
  Top Layer w0.254: U2.10 29.52,19.48 31.31,19.48 31.71,19.08 C12.2 31.02,18.18 v1(30.4,17.56) ; v1(21.8,17.5) 21.8,18.65 R7.1
  Bottom Layer w0.254: v1(30.4,17.56) 30.34,17.5 v1(21.8,17.5)
$1N3614: length 5.9
  Top Layer w0.254: C16.1 23.2,28.1 24.5,26.8 24.5,24.6 U4.1
$1N3615: length 13.9
  Top Layer w0.254: C18.2 19.6,28.1 21,29.5 C16.2 21.63,29.73 L3.1 24.93,29.4 25.18,29.4 25.43,29.15 C80.2 25.7,27.58 25.7,24.4 25.3,24 24.49,24 U4.2
$1N3618: length 2.4
  Top Layer w0.254: U4.3 23.68,23.55 23.53,23.7 22.1,23.7
$1N4241: length 13.5
  Top Layer w0.254: 26.8,15.05 26.8,15.78 26.77,15.81 26.77,15.83 26.3,16.3 26.3,20.2 25.9,20.6 25.9,21.9 25.25,22.55 U4.5 ; 26.8,15.05 25.17,16.68 U2.5 ; 26.8,15.05 X2.3
$1N4589: length 6
  Top Layer w0.254: R5.1 14.12,27.95 15.63,26.45 R3.2 16.5,24.34 U25.6
$1N4663: length 4.3
  Top Layer w0.254: R4.2 19.63,26.2 U25.5
$1N4714: length 14
  Top Layer w0.254: R5.2 14.6,25.95 v1(14.6,25.2) 14.6,23.81 U25.7
  Bottom Layer w0.254: v1(14.6,25.2) 14.57,25.23 H3.1
$1N4922: length 8.5
  Top Layer w0.254: 14.65,18.86 14.5,18.71 14.5,17 13.5,16 10.4,16 R8.1
$1N4931: length 8.4
  Top Layer w0.254: 13.38,18.86 13.38,19.42 13.25,19.55 R8.2 10.32,19.47 H4.2
$1N5138: length 13.8
  Top Layer w0.254: L2.1 21.25,12.62 C14.2 19.8,14.4 C13.2 23.1,17.7 23.1,18.31 ; C11.2 23.1,19.4 23.1,18.31 ; U2.2 23.23,18.18 23.1,18.31
$1N5202: length 13
  Top Layer w0.254: U2.8 29.46,17.68 29.54,17.76 29.57,17.76 29.81,18.01 29.81,18.04 v1(30.2,18.42) ; v1(39.9,18.7) 39.95,18.75 U1.38
  Inner2 w0.254: v1(30.2,18.42) 30.48,18.7 v1(39.9,18.7)
$1N5230: length 10.7
  Top Layer w0.254: U4.10 29.35,24.55 29.4,24.6 C17.2 28.4,26.8 v1(27.8,26.2) ; R4.1 v1(23.25,26.2)
  Bottom Layer w0.254: v1(23.25,26.2) v1(27.8,26.2)
$1N5240: length 19.7
  Top Layer w0.254: v1(34.29,27.2) 34.46,27.2 34.72,27.47 35.43,27.47 U1.21 ; U4.7 27.04,23.05 v1(26.98,23.1) ; v1(26.98,18.32) 26.98,17.82 27.62,17.18 U2.7
  Inner1 w0.254: v1(34.29,27.2) 34.19,27.1 30.4,27.1 26.98,23.68 v1(26.98,23.1) v1(26.98,18.32)
$1N5277: length 14.3
  Top Layer w0.254: U1.37 39.45,23.25 v1(39.5,23.3) ; U4.8 30.12,23.55 v1(30.4,23.26)
  Inner2 w0.254: v1(39.5,23.3) 32.98,23.3 32.8,23.12 30.54,23.12 v1(30.4,23.26)
$1N6288: length 16.1
  Top Layer w0.254: R9.2 C92.2 19.9,62.6 19.3,62 13.7,62 13.2,62.5 13.2,63.8 U7.1
$1N6673: length 30.2
  Top Layer w0.5: U8.3 69.95,14.08 U8.6 70.26,8.34 71.3,7.3 D1.1 77.6,13.55 U15.2
$1N6894: length 6
  Top Layer w0.254: U8.4 60.19,12.32 58.08,12.32 56.1,14.3 55.2,14.3 55.1,14.2
$1N7290: length 11.8
  Top Layer w0.254: R10.1 R12.2 61.05,20.4 R11.2 60.85,19.45 62.13,18.17 62.13,16.79 61.12,15.78 U8.2
$1N7531: length 6.5
  Top Layer w0.254: U9.1 57.2,20.25 R12.1
$1N7563: length 19.9
  Top Layer w0.254: U12.4 55.75,26.55 U9.4 49.55,22.15 v1(48.6,23.1) ; R45.1 48.47,30.52 48.47,28.84 48.14,28.5 46.94,28.5 U1.62
  Bottom Layer w0.254: v1(48.6,23.1) 48.56,23.14 v1(48.56,28.92)
$1N8313: length 4.8
  Top Layer w0.7: C97.2 66.01,30.11 66.61,30.71 U11.4
$1N8343: length 22
  Top Layer w0.5: U11.3 64.91,42.37 U11.6 65.22,50.69 62.52,53.4
$1N8365: length 4.6
  Top Layer w0.254: U12.1 59.82,25.02 61.22,25.02 62.2,26 62.2,27.03 R17.1
$1N14166: length 3.2
  Top Layer w0.254: C47.1 11.72,5.9 11.74,5.88
$1N14170: length 2.9
  Top Layer w0.254: U17.7 9.85,6.45 9.1,7.2
$1N14199: length 2.9
  Top Layer w0.254: U17.3 14.55,6.95 C4.2
$1N14425: length 4.8
  Top Layer w0.254: U17.5 11.98,7.76 R22.1 11.98,11.98 R23.2
$1N14703: length 17.2
  Top Layer w0.254: R17.2 63.2,29.93 U11.2 63.2,34.5 62.15,35.55 R16.2 57.8,39.83 R15.1
$1N14730: length 18.6
  Top Layer w0.254: v1(30.29,16.66) 28.74,16.66 U2.6 ; U4.6 29.75,22.55 30.1,22.2 v1(30.1,20.62) ; U1.23 35.43,26.47 33.87,26.47 v1(33.8,26.4)
  Inner1 w0.254: v1(30.29,16.66) 30.66,16.66 30.98,16.98 30.98,19.02 30.1,19.9 v1(30.1,20.62) 30.1,22.14 33.1,25.14 33.1,25.7 v1(33.8,26.4)
$1N14753: length 22.6
  Top Layer w0.254: U9.5 51.7,21.2 56.1,25.6 U12.5 ; R44.1 49.9,30.45 49.9,28.8 49.49,28.39 v1(49.49,28.28) 49.04,28.28 48.8,28.04 U1.61 ; 51.34,21.19 v1(50.19,21.19)
  Bottom Layer w0.254: v1(50.19,21.19) 49.9,21.19 49.49,21.59 v1(49.49,28.28)
$1N18725: length 8.1
  Top Layer w0.254: R26.1 14,45.3 15.25,46.55 R25.2 17.8,47.5 18.55,46.75 18.55,45.8
$1N18813: length 16.8
  Top Layer w0.254: 17.9,45.8 17.9,44.37 v1(17.81,44.28)
  Bottom Layer w0.254: D5.3 9.73,47.57 10.58,46.72 R28.2 10.9,43.85 R29.2 11.28,43.47 14.19,43.47 15.1,44.38 C51.1 ; 15.2,44.28 v1(17.81,44.28)
$1N21926: length 69.9
  Top Layer w0.254: 29,81.75 32.41,81.75 39.9,74.26 39.9,66.7 v1(40.2,66.4) ; v1(43.4,26) 46.86,26 U1.57
  Inner1 w0.254: v1(40.2,66.4) 40.2,66.3 43.54,62.96 43.54,44.73 40.62,41.81 40.62,28.28 42.9,26 v1(43.4,26)
$1N21936: length 70.3
  Top Layer w0.254: v1(44.85,25.09) 44.9,25.04 U1.55 ; v1(41.56,66.43) 41.48,66.51 41.48,66.61 40.35,67.74 40.35,74.45 32.55,82.25 29,82.25
  Inner1 w0.254: v1(44.85,25.09) 44.5,25.44 44.5,26 42.3,28.2 42.3,35.5 41.3,36.5 41.3,40.81 44.2,43.7 44.2,63.8 v1(41.56,66.43)
$1N21977: length 72.4
  Top Layer w0.254: v1(33,27.68) 33,25.1 34.49,23.61 35.43,23.61 U1.29 ; 29,82.75 32.75,82.75 42.13,73.37 v1(42.17,73.37)
  Inner1 w0.254: v1(33,27.68) v1(33,34) ; v1(42.3,62.5) 42.3,56.8 36,50.5 v1(36,40.8)
  Bottom Layer w0.254: v1(33,34) 33,37.8 v1(36,40.8) ; v1(42.17,73.37) 42.17,62.63 v1(42.3,62.5)
$1N22025: length 76.2
  Top Layer w0.254: v1(38.3,27.6) 37.45,26.75 U1.33 ; 29,83.25 33.8,83.25 v1(43.4,73.65)
  Inner1 w0.254: v1(36.8,53.7) 36.8,67.05 v1(43.4,73.65)
  Bottom Layer w0.254: v1(38.3,27.6) 38.94,28.24 38.94,44.46 36.8,46.6 v1(36.8,53.7)
$1N22161: length 31.3
  Top Layer w0.254: 18.53,40.42 16.52,40.42 R26.2 ; 18.53,40.42 19.38,40.42 ; 18.53,40.42 U18.7 ; v1(35.4,31.3) 37.4,31.3 37.45,31.35 U1.16 ; 19.41,40.4 19.8,40.4 20.91,39.29 23.91,39.29 28.66,34.54 28.66,31.67 v1(29.04,31.29)
  Bottom Layer w0.254: v1(29.04,31.29) 35.39,31.29 v1(35.4,31.3)
$1N22287: length 48.8
  Top Layer w0.254: v1(38,32.9) 37.95,32.85 U1.15 ; v1(35.3,54.5) v1(35.3,56.7) ; R31.2 v1(29.5,73.5)
  Bottom Layer w0.254: v1(29.5,73.5) 35.3,67.7 v1(35.3,56.7) ; v1(35.3,54.5) 35.3,54 32.9,51.6 32.9,47.1 38,42 v1(38,32.9)
$1N22291: length 8.6
  Top Layer w0.254: 19.95,77.75 24.2,73.5 R31.1
$1N22318: length 11.5
  Top Layer w0.254: R32.2 23.15,83.65 23.4,83.4 23.4,78.9 23.58,78.72 28.97,78.72 29,78.75
$1N22321: length 2.6
  Top Layer w0.254: R32.1 22.2,81.35 20.9,80.05
$1N22726: length 28.7
  Top Layer w0.254: U1.17 35.46,29.5 v1(34,29.5) ; R34.2 14.3,39.85 v1(16.1,39.85) 16.12,39.87 17.83,39.87 18.08,39.62 U20.7
  Inner1 w0.254: v1(16.1,39.85) 19.35,39.85 28.9,30.3 v1(29,30.3)
  Bottom Layer w0.254: v1(29,30.3) 29.8,29.5 v1(34,29.5)
$1N22732: length 7.5
  Top Layer w0.254: U20.2 18.08,34.62 17.89,34.81 17.89,35.31 17.04,36.15 R33.2 R34.1
$1N22733: length 22.2
  Top Layer w0.254: v1(18.7,35.7) 18.7,34.48 18.72,34.45
  Bottom Layer w0.254: R36.2 10.9,33.7 13.2,31.4 D6.3 17.35,30.1 18.05,30.8 18.8,30.8 18.8,30.8 R35.2 17.05,31.55 16.59,32.01 C53.1 17.09,35.7 v1(18.7,35.7)
$1N22742: length 3.8
  Bottom Layer w0.254: H8.1 6.05,33.63 R36.1
$1N26018: length 87.5
  Top Layer w0.254: R37.1 98.04,5.61 75.01,5.61 74.1,4.7 54.7,4.7 51.9,7.5 38.5,7.5 36.8,9.2 36.8,28 38.45,29.65 U1.14
$1N26022: length 3.2
  Top Layer w0.254: 96.35,2.62 97.25,2.62 R37.2
$1N26280: length 5.7
  Top Layer w0.254: 90.35,2.62 93.42,2.62 LED1.1
$1N26466: length 5.7
  Top Layer w0.254: 84.35,2.62 87.42,2.62 LED2.1
$1N26583: length 6.7
  Top Layer w0.254: LED3.1 81.42,2.62 77.35,2.62
$1N26700: length 6.7
  Top Layer w0.254: LED4.1 72.74,0.78 70.91,2.62 70.35,2.62
$1N26817: length 13.8
  Top Layer w0.254: LED5.1 58.88,0.78 LED6.3
$1N26936: length 6.5
  Top Layer w0.254: 55.35,1.38 53.81,1.38 52.25,2.95 49.59,2.95 49.55,2.91
$1N30201: length 6.7
  Top Layer w0.254: 41.45,1.09 39.35,1.09 38.42,2.01 36.45,2.01 LED9.3
$1N30205: length 6.7
  Top Layer w0.254: LED9.1 32.62,2.91 LED10.3
$1N30209: length 5.7
  Top Layer w0.254: LED11.3 24.38,1.09 LED10.1
$1N30213: length 5.7
  Top Layer w0.254: LED11.1 18.38,1.09 LED12.3
$1N30937: length 5.7
  Top Layer w0.254: LED12.1 12.38,1.09 LED13.3
$1N30941: length 6.7
  Top Layer w0.254: LED14.3 5.38,1.09 LED13.1
$1N34226: length 2.5
  Top Layer w0.254: 32.92,56.3 33.48,56.86 U22.1
$1N34610: length 5.9
  Top Layer w0.254: U22.3 36.37,60.51 R39.2 36.46,57.9 R38.1
$1N34796: length 11.1
  Top Layer w0.5: U22.6 31.8,57.59 C70.1 28.1,56.3 27.03,55.23 L16.1
$1N34941: length 4.6
  Top Layer w0.254: U22.4 32.55,62.28 32.55,64.4
$1N35020: length 27
  Top Layer w0.254: U1.52 46.87,23.57 43.73,23.57 38.95,28.35 U1.13 38.95,32.78 36.73,35 C9.1 31,35 32.77,33.23 32.77,32.1 L1.1
$1N39030: length 30.4
  Top Layer w0.254: v1(44.89,21.58) 44.53,21.58 43.95,21 U1.46
  Inner1 w0.254: v1(28.7,39.2) 44.89,23.01 v1(44.89,21.58)
  Inner2 w0.254: v1(28.7,39.2) 28.66,39.2 H1.4
$1N39037: length 30.8
  Top Layer w0.254: v1(45.64,22.02) 46.88,22.02 U1.49
  Inner2 w0.254: v1(45.64,22.02) 45.64,28.78 36.34,38.09 32.31,38.09 H1.3
$1N45861: length 20.4
  Top Layer w0.254: U7.7 16.15,69.75 16.15,68.95 15.8,68.6 12.3,68.6 10.4,70.5 9.62,70.5 USBC1.A5 8.15,70.55 6.3,72.4 6.3,76.1 D8.1
$1N45870: length 20.9
  Top Layer w0.254: v1(11.6,67.5) 11.55,67.55 USBC1.B5 ; U7.6 17.3,68.6 v1(17.2,68.5) ; D7.1 16,78.7 v1(16,77)
  Bottom Layer w0.254: v1(11.6,67.5) 17,67.5 17.2,67.7 v1(17.2,68.5) 17.2,71.74 15.9,73.04 15.9,76.9 v1(16,77)
$1N47534: length 3.4
  Bottom Layer w0.254: R29.1 8.09,43.7 H7.1
$1N51078: length 23.1
  Top Layer w0.5: 22.8,71.35 22.5,71.65 R9.1 19.3,71.65 19.25,71.7 15.26,71.7 ; 15.26,71.7 15.3,71.66 U7.8 ; 15.26,71.7 11.51,71.7 ; D9.1 9.7,75.6 11.5,73.8 11.5,71.71 11.51,71.7 ; 11.51,71.7 USBC1.A4B9
$1N51620: length 2.9
  Top Layer w0.254: C76.2 47.22,56.62 47.95,57.35 U23.1
$1N51622: length 4.6
  Top Layer w0.254: U23.3 48.95,60.45 49.4,60.9 R43.2 50.7,60.77 50.7,59.13
$1N51629: length 6.8
  Top Layer w0.254: U23.6 45.25,56.55 45.8,56 C76.1 46.38,55.28 45.57,54.47 L15.1
$1N59316: length 2.8
  Top Layer w0.254: U1.30 33.06,23.04 C10.2
$1N79865: length 3
  Top Layer w0.254: USBC2.B5 12.3,90.12 12.61,89.8
$1N79871: length 3.3
  Top Layer w0.254: 12.61,93.99 11.74,93.12 USBC2.A5
$1N84112: length 6.2
  Top Layer w0.254: R7.2 18.65,20.3 16.32,20.3 15.92,19.9 15.92,18.86
$1N88101: length 106.3
  Top Layer w0.254: 9.7,91.62 v1(8.4,91.62) 8.4,92.3 8.72,92.62 9.7,92.62 ; U1.44 42.95,21.13 42.9,21.18 42.9,21.32 v1(42.71,21.51)
  Inner1 w0.254: v1(18.4,22.5) 14.2,22.5 7.53,29.17 7.53,88.98 8.4,89.86 v1(8.4,91.62)
  Bottom Layer w0.254: v1(18.4,22.5) 22,22.5 23.24,21.26 40.02,21.26 40.28,21.51 v1(42.71,21.51)
$1N88141: length 106.3
  Top Layer w0.254: 11.2,92.12 12.07,92.12 v1(12.15,92.2) ; 11.2,92.12 USBC2.A6 ; 11.2,92.12 11.2,91.3 11.02,91.12 USBC2.B6 ; v1(43.4,22.3) 43.45,22.25 U1.45
  Bottom Layer w0.254: v1(43.4,22.3) 43.18,22.52 23.01,22.52 19.62,25.91 19.62,57.02 20.05,57.45 20.05,91.55 19.4,92.2 v1(12.15,92.2)
$1N102107: length 5.1
  Top Layer w0.254: R48.1 56.51,42.63 R15.2
$1N102112: length 47.8
  Top Layer w0.254: R48.2 56.51,53.41 60,56.9 69.11,56.9 L14.2
  Top Layer w0.5: L14.2 72.03,47.97 73.3,46.7 D2.1 75.3,47.4 C95.1 78.75,51.1 C83.1 80.4,52.95 H6.2
$1N102197: length 5.6
  Top Layer w0.254: LED8.3 42.65,4.4 41.93,5.12 39.28,5.12 R50.2
$1N102205: length 22.7
  Top Layer w0.254: R50.1 36.53,5.72 v1(36.53,7.93) ; v1(34.23,24.93) 34.68,24.93 34.72,24.97 35.43,24.97 U1.26
  Inner1 w0.254: 34.15,24.85 34.15,23.65 36.53,21.27 v1(36.53,7.93)
$1N106263: length 6.2
  Top Layer w0.254: R51.1 85.65,21.2 R49.2
$1N106296: length 24.2
  Top Layer w0.254: R51.2 89.9,21 92.2,18.7
  Top Layer w0.5: C82.1 91,17.45 91,14.65 91,14.65 91,11.3 ; C88.1 89.2,10.9 87.28,12.82 U15.1 ; 92.25,18.6 92.75,18.1 H5.2
$1N106370: length 5.2
  Top Layer w0.254: R10.2 69.05,22.6 R52.1
$1N106372: length 6.4
  Top Layer w0.254: R52.2 71.95,21.2 R49.1
$1N114591: length 68.4
  Top Layer w0.254: v1(39.3,15.3) 39.3,16.18 C104.2 38.95,16.53 U1.36
  Bottom Layer w0.254: 71.78,24.9 71.78,24.85 71.8,24.82 ; 71.78,24.9 72.19,25.32 72.24,25.32 72.58,25.66 72.58,25.71 72.88,26 93.3,26 94.58,27.28 94.58,29.69 SW1.D ; 71.78,24.9 65.07,24.9 61.79,21.62 ; v1(39.3,15.3) 39.35,15.35 42.25,15.35 45.32,18.42 53.45,18.42 56.55,21.53 61.69,21.53 61.79,21.62 ; 61.79,21.62 61.84,21.62
$1N114599: length 55.8
  Top Layer w0.254: v1(53.6,27.4) 52.8,26.6 52.18,26.6 ; 52.28,26.5 52.2,26.58 51.98,26.58 51.94,26.54 U1.58
  Bottom Layer w0.254: SW1.A 92.99,42.6 87.6,42.6 72.5,27.5 53.77,27.5 53.67,27.4 v1(53.6,27.4)
$1N114607: length 52
  Top Layer w0.254: U1.59 49.94,27.04 49.96,27.02 50.44,27.02 50.46,27.04 50.84,27.04 51,27.2 51,29.02 C102.1 51.18,30.18 51.46,30.46 v1(53.8,30.46)
  Bottom Layer w0.254: SW1.B 87.72,44.65 73.49,30.42 53.84,30.42 v1(53.8,30.46)
$1N131496: length 18.3
  Top Layer w0.254: 24.4,85.4 24.4,85.5 ; 24.4,85.4 26.3,87.3 SW2.2 ; 24.4,85.4 24.4,81.7 24.85,81.25 29,81.25

## Copper pours and planes (outline as drawn; the poured copper is in the pictures)
+3.3V on Inner2: 0.3,99.2 99.7,99.2 99.7,7.6 0.3,7.6
+5V on Inner2: 0.3,7.2 99.6,7.2 99.6,0.3 0.3,0.3
GND on Top Layer: 0,100 100,100 100,0.2 0,0.2
GND on Bottom Layer: -0.2,100.1 100,100.1 100,0 -0.2,0
GND on Inner1: 0,99.6 100,99.6 100,0 0,0
